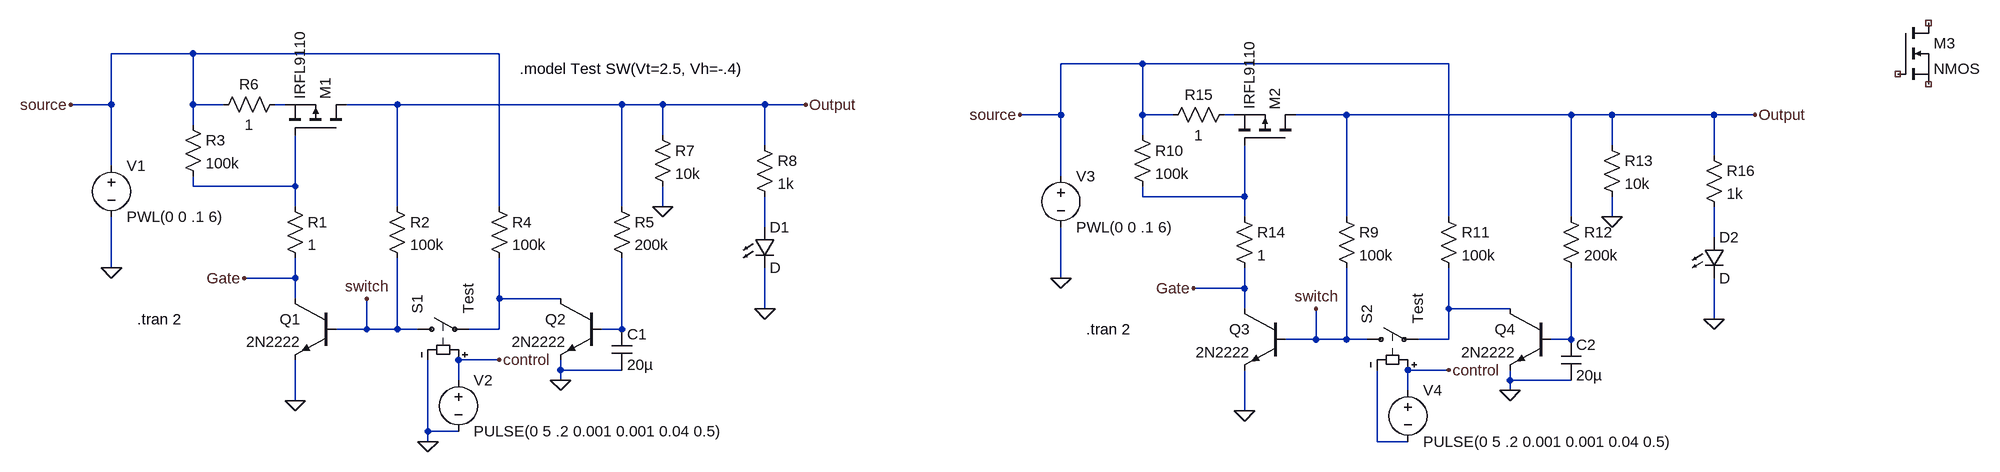
[diagram p0: schematic Draft2.asc]
Draft2.asc, the LTspice schematic file:
Version 4
SHEET 1 2740 696
WIRE -64 48 -192 48
WIRE 416 48 -64 48
WIRE 1424 64 1296 64
WIRE 1904 64 1424 64
WIRE -192 128 -192 48
WIRE -192 128 -256 128
WIRE -64 128 -64 48
WIRE -16 128 -64 128
WIRE 80 128 64 128
WIRE 256 128 176 128
WIRE 608 128 256 128
WIRE 672 128 608 128
WIRE 832 128 672 128
WIRE 896 128 832 128
WIRE 1296 144 1296 64
WIRE 1296 144 1232 144
WIRE 1424 144 1424 64
WIRE 1472 144 1424 144
WIRE 1568 144 1552 144
WIRE 1744 144 1664 144
WIRE 2096 144 1744 144
WIRE 2160 144 2096 144
WIRE 2320 144 2160 144
WIRE 2384 144 2320 144
WIRE -64 160 -64 128
WIRE 672 176 672 128
WIRE 1424 176 1424 144
WIRE 832 192 832 128
WIRE 2160 192 2160 144
WIRE 2320 208 2320 144
WIRE -192 224 -192 128
WIRE 1296 240 1296 144
WIRE -64 256 -64 240
WIRE 96 256 96 176
WIRE 96 256 -64 256
WIRE 1424 272 1424 256
WIRE 1584 272 1584 192
WIRE 1584 272 1424 272
WIRE 96 288 96 256
WIRE 256 288 256 128
WIRE 416 288 416 48
WIRE 608 288 608 128
WIRE 672 288 672 256
WIRE 1584 304 1584 272
WIRE 1744 304 1744 144
WIRE 1904 304 1904 64
WIRE 2096 304 2096 144
WIRE 2160 304 2160 272
WIRE 832 320 832 272
WIRE 2320 336 2320 288
WIRE -192 384 -192 304
WIRE 96 400 96 368
WIRE 96 400 16 400
WIRE 1296 400 1296 320
WIRE 1584 416 1584 384
WIRE 1584 416 1504 416
WIRE 96 432 96 400
WIRE 416 432 416 368
WIRE 512 432 416 432
WIRE 832 448 832 384
WIRE 1584 448 1584 416
WIRE 1904 448 1904 384
WIRE 2000 448 1904 448
WIRE 2320 464 2320 400
WIRE 208 480 208 432
WIRE 208 480 160 480
WIRE 256 480 256 368
WIRE 256 480 208 480
WIRE 288 480 256 480
WIRE 416 480 416 432
WIRE 416 480 368 480
WIRE 608 480 608 368
WIRE 608 480 576 480
WIRE 1696 496 1696 448
WIRE 1696 496 1648 496
WIRE 1744 496 1744 384
WIRE 1744 496 1696 496
WIRE 1776 496 1744 496
WIRE 1904 496 1904 448
WIRE 1904 496 1856 496
WIRE 2096 496 2096 384
WIRE 2096 496 2064 496
WIRE 416 528 352 528
WIRE 512 544 512 528
WIRE 608 544 512 544
WIRE 1904 544 1840 544
WIRE 352 560 352 528
WIRE 512 560 512 544
WIRE 2000 560 2000 544
WIRE 2096 560 2000 560
WIRE 1840 576 1840 544
WIRE 2000 576 2000 560
WIRE 96 592 96 528
WIRE 1584 608 1584 544
WIRE 304 640 304 528
WIRE 352 640 304 640
WIRE 304 656 304 640
WIRE 1792 656 1792 544
WIRE 1840 656 1792 656
FLAG 96 592 0
FLAG 512 560 0
FLAG 304 656 0
FLAG -192 384 0
FLAG 896 128 Output
FLAG 672 288 0
FLAG 16 400 Gate
FLAG 208 432 switch
FLAG 416 528 control
FLAG -256 128 source
FLAG 832 448 0
FLAG 1584 608 0
FLAG 2000 576 0
FLAG 1296 400 0
FLAG 2384 144 Output
FLAG 2160 304 0
FLAG 1504 416 Gate
FLAG 1696 448 switch
FLAG 1904 544 control
FLAG 1232 144 source
FLAG 2320 464 0
SYMBOL pmos 176 176 M270
SYMATTR InstName M1
SYMATTR Value IRFL9110
SYMBOL res 240 272 R0
SYMATTR InstName R2
SYMATTR Value 100k
SYMBOL res -80 144 R0
SYMATTR InstName R3
SYMATTR Value 100k
SYMBOL npn 160 432 M0
SYMATTR InstName Q1
SYMATTR Value 2N2222
SYMBOL res 400 272 R0
SYMATTR InstName R4
SYMATTR Value 100k
SYMBOL sw 272 480 R270
SYMATTR InstName S1
SYMATTR Value Test
SYMBOL npn 576 432 M0
SYMATTR InstName Q2
SYMATTR Value 2N2222
SYMBOL res 592 272 R0
SYMATTR InstName R5
SYMATTR Value 200k
SYMBOL voltage -192 208 R0
WINDOW 123 0 0 Left 0
WINDOW 39 0 0 Left 0
SYMATTR InstName V1
SYMATTR Value PWL(0 0 .1 6)
SYMBOL voltage 352 544 R0
WINDOW 123 0 0 Left 0
WINDOW 39 0 0 Left 0
SYMATTR InstName V2
SYMATTR Value PULSE(0 5 .2 0.001 0.001 0.04 0.5)
SYMBOL cap 592 480 R0
SYMATTR InstName C1
SYMATTR Value 20µ
SYMBOL res 656 160 R0
SYMATTR InstName R7
SYMATTR Value 10k
SYMBOL res 80 272 R0
SYMATTR InstName R1
SYMATTR Value 1
SYMBOL res 80 112 R90
WINDOW 0 0 56 VBottom 2
WINDOW 3 32 56 VTop 2
SYMATTR InstName R6
SYMATTR Value 1
SYMBOL res 816 176 R0
SYMATTR InstName R8
SYMATTR Value 1k
SYMBOL LED 816 320 R0
SYMATTR InstName D1
SYMBOL pmos 1664 192 M270
SYMATTR InstName M2
SYMATTR Value IRFL9110
SYMBOL res 1728 288 R0
SYMATTR InstName R9
SYMATTR Value 100k
SYMBOL res 1408 160 R0
SYMATTR InstName R10
SYMATTR Value 100k
SYMBOL npn 1648 448 M0
SYMATTR InstName Q3
SYMATTR Value 2N2222
SYMBOL res 1888 288 R0
SYMATTR InstName R11
SYMATTR Value 100k
SYMBOL sw 1760 496 R270
SYMATTR InstName S2
SYMATTR Value Test
SYMBOL npn 2064 448 M0
SYMATTR InstName Q4
SYMATTR Value 2N2222
SYMBOL res 2080 288 R0
SYMATTR InstName R12
SYMATTR Value 200k
SYMBOL voltage 1296 224 R0
WINDOW 123 0 0 Left 0
WINDOW 39 0 0 Left 0
SYMATTR InstName V3
SYMATTR Value PWL(0 0 .1 6)
SYMBOL voltage 1840 560 R0
WINDOW 123 0 0 Left 0
WINDOW 39 0 0 Left 0
SYMATTR InstName V4
SYMATTR Value PULSE(0 5 .2 0.001 0.001 0.04 0.5)
SYMBOL cap 2080 496 R0
SYMATTR InstName C2
SYMATTR Value 20µ
SYMBOL res 2144 176 R0
SYMATTR InstName R13
SYMATTR Value 10k
SYMBOL res 1568 288 R0
SYMATTR InstName R14
SYMATTR Value 1
SYMBOL res 1568 128 R90
WINDOW 0 0 56 VBottom 2
WINDOW 3 32 56 VTop 2
SYMATTR InstName R15
SYMATTR Value 1
SYMBOL res 2304 192 R0
SYMATTR InstName R16
SYMATTR Value 1k
SYMBOL LED 2304 336 R0
SYMATTR InstName D2
SYMBOL nmos 2608 0 R0
SYMATTR InstName M3
TEXT 448 72 Left 2 !.model Test SW(Vt=2.5, Vh=-.4)
TEXT -152 464 Left 2 !.tran 2
TEXT 1336 480 Left 2 !.tran 2

The netlist it stands for:
* Draft2.asc
M1 Output N003 N001 N001 IRFL9110
R2 Output switch 100k
R3 source N003 100k
Q1 Gate switch 0 0 2N2222
R4 source N007 100k
S1 switch N007 control 0 Test
Q2 N007 N009 0 0 2N2222
R5 Output N009 200k
V1 source 0 PWL(0 0 .1 6)
V2 control 0 PULSE(0 5 .2 0.001 0.001 0.04 0.5)
C1 N009 0 20µ
R7 Output 0 10k
R1 N003 Gate 1
R6 N001 source 1
R8 Output N005 1k
D1 N005 0 D
M2 Output N004 N002 N002 IRFL9110
R9 Output switch 100k
R10 source N004 100k
Q3 Gate switch 0 0 2N2222
R11 source N008 100k
S2 switch N008 control N011 Test
Q4 N008 N010 0 0 2N2222
R12 Output N010 200k
V3 source 0 PWL(0 0 .1 6)
V4 control N011 PULSE(0 5 .2 0.001 0.001 0.04 0.5)
C2 N010 0 20µ
R13 Output 0 10k
R14 N004 Gate 1
R15 N002 source 1
R16 Output N006 1k
D2 N006 0 D
M3 NC_01 NC_02 NC_03 NC_03 NMOS
.model D D
.lib standard.dio
.model NPN NPN
.model PNP PNP
.lib standard.bjt
.model NMOS NMOS
.model PMOS PMOS
.lib standard.mos
.model Test SW(Vt=2.5, Vh=-.4)
.tran 2
.tran 2
.backanno
.end